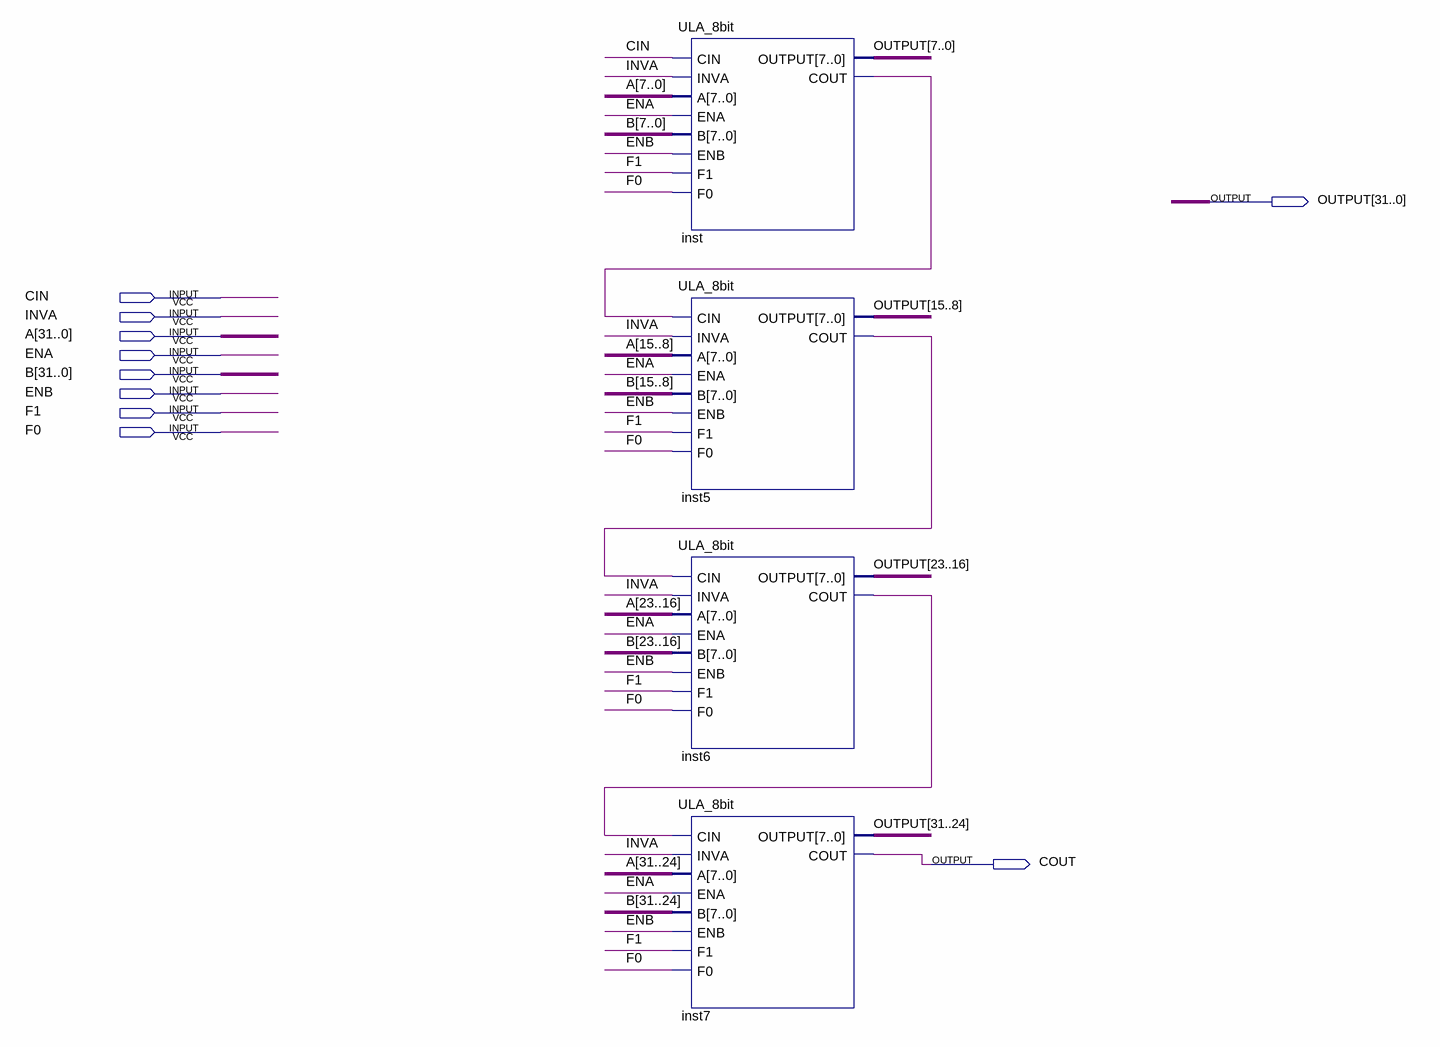
[diagram p0: schematic sheet]
// Quartus schematic ULA_32bit.bdf as structural Verilog: 4 symbols, 10 pins
module ULA_32bit (
  input  CIN,
  input  INVA,
  input  [31:0] A,
  input  ENA,
  input  [31:0] B,
  input  ENB,
  input  F1,
  input  F0,
  output [31:0] OUTPUT,
  output COUT
);

  wire inst5_cout, inst6_cout, inst_cout;

  ULA_8bit inst (
    .CIN(CIN), .INVA(INVA), .A(A[7:0]), .ENA(ENA), .B(B[7:0]), .ENB(ENB), .F1(F1), .F0(F0),
    .OUTPUT(OUTPUT[7:0]), .COUT(inst_cout));
  ULA_8bit inst5 (
    .CIN(inst_cout), .INVA(INVA), .A(A[15:8]), .ENA(ENA), .B(B[15:8]), .ENB(ENB), .F1(F1), .F0(F0),
    .OUTPUT(OUTPUT[15:8]), .COUT(inst5_cout));
  ULA_8bit inst6 (
    .CIN(inst5_cout), .INVA(INVA), .A(A[23:16]), .ENA(ENA), .B(B[23:16]), .ENB(ENB), .F1(F1), .F0(F0),
    .OUTPUT(OUTPUT[23:16]), .COUT(inst6_cout));
  ULA_8bit inst7 (
    .CIN(inst6_cout), .INVA(INVA), .A(A[31:24]), .ENA(ENA), .B(B[31:24]), .ENB(ENB), .F1(F1), .F0(F0),
    .OUTPUT(OUTPUT[31:24]), .COUT(COUT));
endmodule
